# EasyEDA Pro project 8-Bit Breadboard Computer Schematics.eprj

# Schematic PC
Create Date: 2025-08-08; Page Name: Program Counter; Project Name: 8-Bit Breadboard Computer Schematics; Schematic Name: PC; Update Date: 2025-08-18; Company: EasyEDA.com; Page Size: A4; Version: V1.0
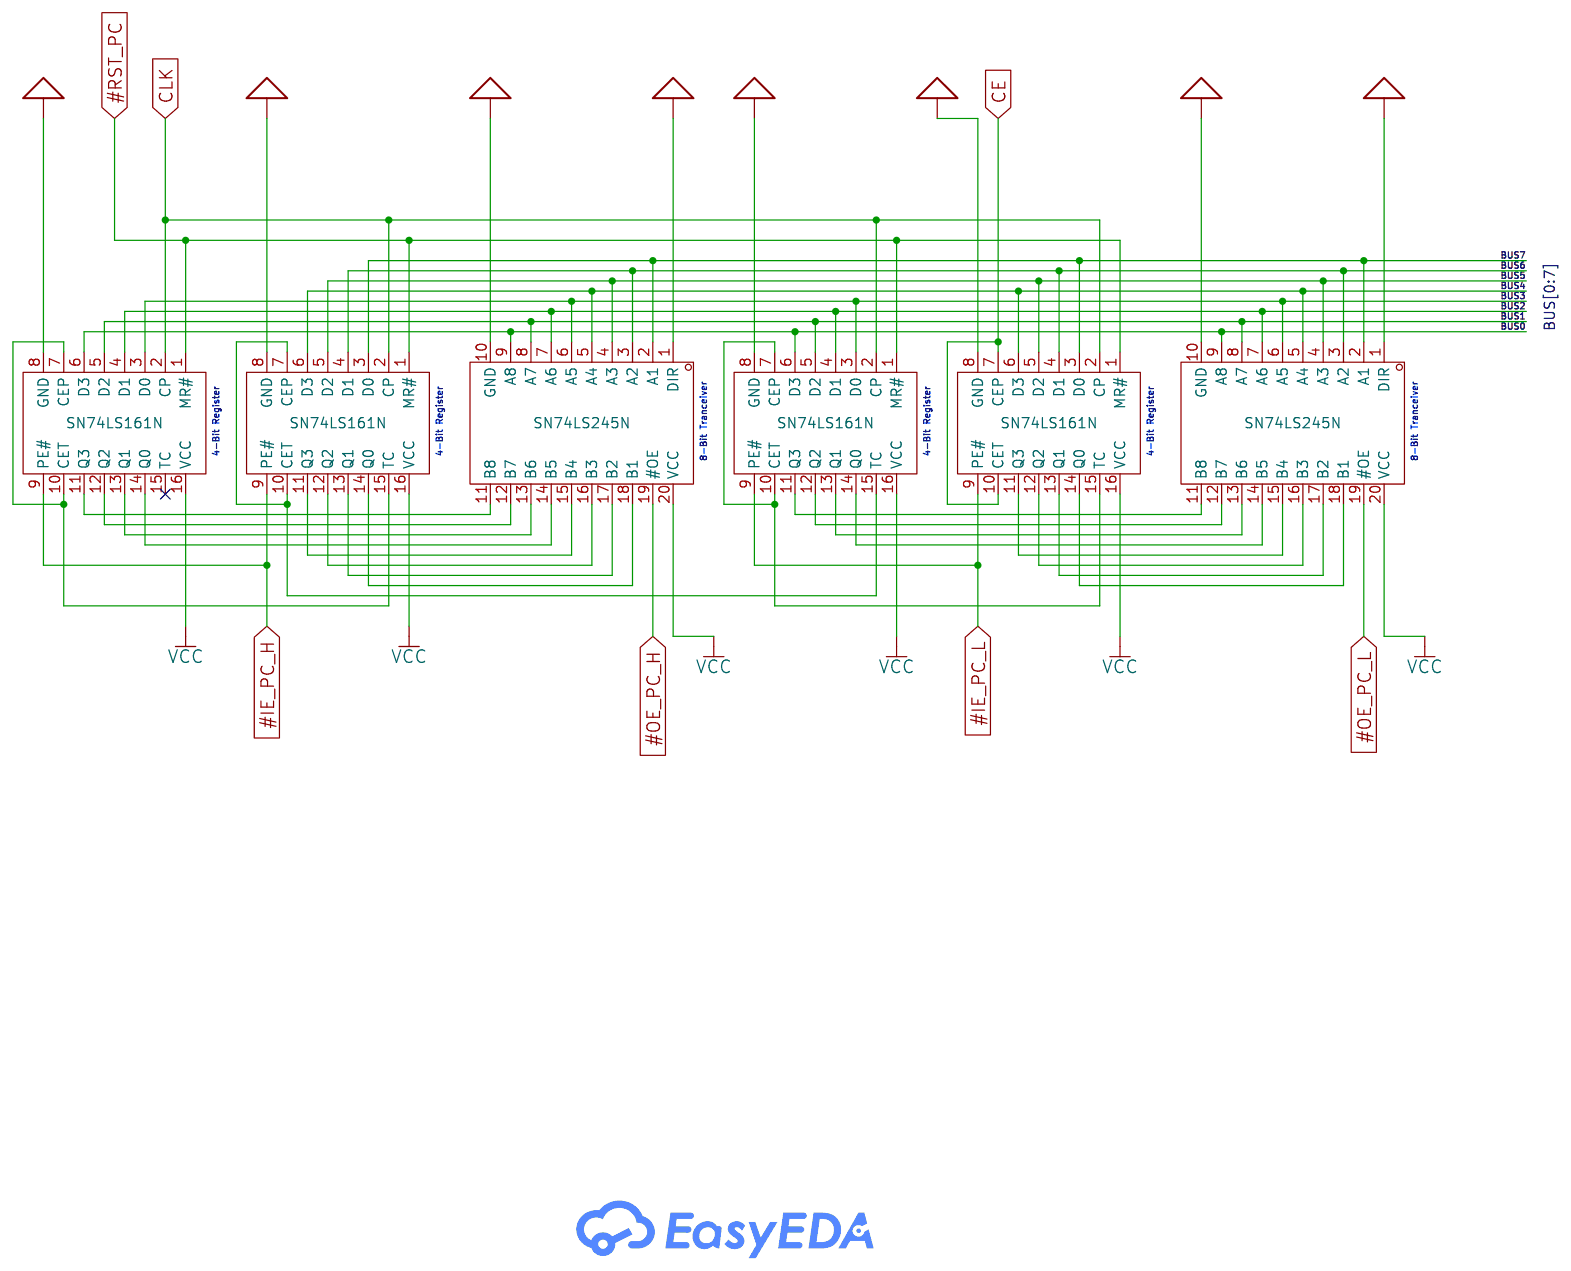
[diagram p0: schematic sheet]

## Parts
U6  SN74LS245N  [DIP-20_L25.5-W10.0-P2.54-LS7.6-BL]
U7  SN74LS161N  [PDIP-16_L19.3-W6.4-P2.54-LS7.94-BL]
U11  SN74LS161N  [PDIP-16_L19.3-W6.4-P2.54-LS7.94-BL]
U12  SN74LS245N  [DIP-20_L25.5-W10.0-P2.54-LS7.6-BL]
U13  SN74LS161N  [PDIP-16_L19.3-W6.4-P2.54-LS7.94-BL]
U14  SN74LS161N  [PDIP-16_L19.3-W6.4-P2.54-LS7.94-BL]

## Library data of the parts
U6 U12 = SN74LS245N: Supplier Part: C352966; Manufacturer: TI(德州仪器); Supplier Footprint: DIP-20; JLCPCB Part Class: Extended Part; Datasheet: https://www.ti.com/cn/lit/gpn/sn74ls245; Supplier: LCSC; output type: Tri-State; Voltage - Supply: 4.75V~5.25V; Number of Elements: 1; Number of Bits per Element: 8; Current - Output Low(IOL): 24mA; Current - Output High(IOH): 15mA; Logic Family: 74LS; Operating Temperature: 0℃~+70℃
U7 U11 U13 U14 = SN74LS161N(LX): Supplier Part: C22449622; Manufacturer: LX(灵星芯微); Supplier Footprint: DIP-16; JLCPCB Part Class: Extended Part; Datasheet: https://atta.szlcsc.com/upload/public/pdf/source/20240603/93FAE93C61248A77FCA8A2A231F511F6.pdf; Supplier: LCSC; Logic Type: 2-way split; Direction: Up Counter; Voltage - Supply: 2V~6V; Number of Elements: 1; Trigger Type: Rising Edge; Reset: Asynchronous; Timing: Synchronous; Count Rate: 27MHz; Operating Temperature: -40℃~+125℃

## Nets
GND: U6.1(DIR) U6.10(GND) U7.8(GND) U11.8(GND) U12.1(DIR) U12.10(GND) U13.8(GND) U14.8(GND)
VCC: U6.20(VCC) U7.16(VCC) U11.16(VCC) U12.20(VCC) U13.16(VCC) U14.16(VCC)
#IE_PC_H: U7.9(PE#) U11.9(PE#)
#IE_PC_L: U13.9(PE#) U14.9(PE#)
#OE_PC_H: U6.19(#OE)
#OE_PC_L: U12.19(#OE)
#RST_PC: U7.1(MR#) U11.1(MR#) U13.1(MR#) U14.1(MR#)
BUS0: U6.9(A8) U11.6(D3) U12.9(A8) U14.6(D3)
BUS1: U6.8(A7) U11.5(D2) U12.8(A7) U14.5(D2)
BUS2: U6.7(A6) U11.4(D1) U12.7(A6) U14.4(D1)
BUS3: U6.6(A5) U11.3(D0) U12.6(A5) U14.3(D0)
BUS4: U6.5(A4) U7.6(D3) U12.5(A4) U13.6(D3)
BUS5: U6.4(A3) U7.5(D2) U12.4(A3) U13.5(D2)
BUS6: U6.3(A2) U7.4(D1) U12.3(A2) U13.4(D1)
BUS7: U6.2(A1) U7.3(D0) U12.2(A1) U13.3(D0)
CE: U13.7(CEP) U13.10(CET)
CLK: U7.2(CP) U11.2(CP) U13.2(CP) U14.2(CP)
Net-(U6-11): U6.11(B8) U11.11(Q3)
Net-(U6-12): U6.12(B7) U11.12(Q2)
Net-(U6-13): U6.13(B6) U11.13(Q1)
Net-(U6-14): U6.14(B5) U11.14(Q0)
Net-(U6-15): U6.15(B4) U7.11(Q3)
Net-(U6-16): U6.16(B3) U7.12(Q2)
Net-(U6-17): U6.17(B2) U7.13(Q1)
Net-(U6-18): U6.18(B1) U7.14(Q0)
Net-(U7-7): U7.7(CEP) U7.10(CET) U14.15(TC)
Net-(U7-15): U7.15(TC) U11.7(CEP) U11.10(CET)
Net-(U12-11): U12.11(B8) U14.11(Q3)
Net-(U12-12): U12.12(B7) U14.12(Q2)
Net-(U12-13): U12.13(B6) U14.13(Q1)
Net-(U12-14): U12.14(B5) U14.14(Q0)
Net-(U12-15): U12.15(B4) U13.11(Q3)
Net-(U12-16): U12.16(B3) U13.12(Q2)
Net-(U12-17): U12.17(B2) U13.13(Q1)
Net-(U12-18): U12.18(B1) U13.14(Q0)
Net-(U13-15): U13.15(TC) U14.7(CEP) U14.10(CET)

Not connected (* = marked no-connect by the designer): U11 15(TC)*

## Notes on the sheet
- 4-Bit Register
- 4-Bit Register
- 8-Bit Tranceiver
- 4-Bit Register
- 4-Bit Register
- 8-Bit Tranceiver

# Schematic A-Regsiter
Create Date: 2025-08-08; Page Name: A-Regsiter; Project Name: 8-Bit Breadboard Computer Schematics; Schematic Name: A-Regsiter; Update Date: 2025-08-20; Company: EasyEDA.com; Page Size: A4; Version: V1.0
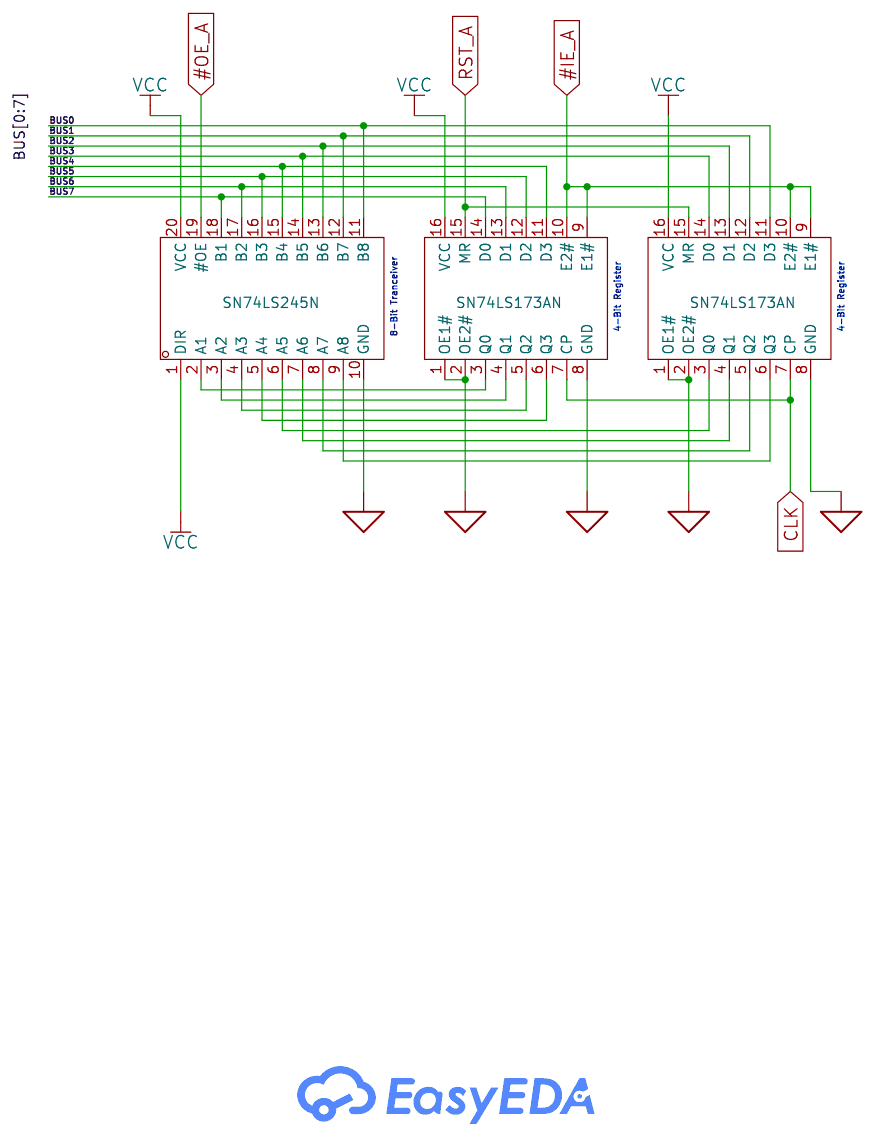
[diagram p1: schematic sheet]

## Parts
U1  SN74LS245N  [DIP-20_L25.5-W10.0-P2.54-LS7.6-BL]
U2  SN74LS173AN  [PDIP-16_L19.3-W6.4-P2.54-LS7.94-BL]
U3  SN74LS173AN  [PDIP-16_L19.3-W6.4-P2.54-LS7.94-BL]

## Library data of the parts
U1 = SN74LS245N: Supplier Part: C352966; Manufacturer: TI(德州仪器); Supplier Footprint: DIP-20; JLCPCB Part Class: Extended Part; Datasheet: https://www.ti.com/cn/lit/gpn/sn74ls245; Supplier: LCSC; output type: Tri-State; Voltage - Supply: 4.75V~5.25V; Number of Elements: 1; Number of Bits per Element: 8; Current - Output Low(IOL): 24mA; Current - Output High(IOH): 15mA; Logic Family: 74LS; Operating Temperature: 0℃~+70℃
U2 U3 = SN74LS173N(LX): LCSC Part Name: SN74LS173N; Supplier Part: C22466320; Manufacturer: LX(灵星芯微); Supplier Footprint: DIP-16; JLCPCB Part Class: Extended Part; Datasheet: https://atta.szlcsc.com/upload/public/pdf/source/20240614/F3FD9DFBB4BF77D77E15C2CBAE389656.pdf; Supplier: LCSC; Type: D-Type; Trigger Type: Rising Edge; Voltage - Supply: 2V~6V; Clock Frequency: 35MHz; Function: Reset; Number of Elements: 1; Number of Bits per Element: 4; Propagation Delay: 30ns@6V,50pF; Series: 74LS Series; Quiescent Current: 8uA; Operating Temperature: -40℃~+125℃

## Nets
GND: U1.10(GND) U2.1(OE1#) U2.2(OE2#) U2.8(GND) U3.1(OE1#) U3.2(OE2#) U3.8(GND)
VCC: U1.1(DIR) U1.20(VCC) U2.16(VCC) U3.16(VCC)
#IE_A: U2.9(E1#) U2.10(E2#) U3.9(E1#) U3.10(E2#)
#OE_A: U1.19(#OE)
BUS0: U1.11(B8) U3.11(D3)
BUS1: U1.12(B7) U3.12(D2)
BUS2: U1.13(B6) U3.13(D1)
BUS3: U1.14(B5) U3.14(D0)
BUS4: U1.15(B4) U2.11(D3)
BUS5: U1.16(B3) U2.12(D2)
BUS6: U1.17(B2) U2.13(D1)
BUS7: U1.18(B1) U2.14(D0)
CLK: U2.7(CP) U3.7(CP)
RST_A: U2.15(MR) U3.15(MR)
Net-(U1-2): U1.2(A1) U2.3(Q0)
Net-(U1-3): U1.3(A2) U2.4(Q1)
Net-(U1-4): U1.4(A3) U2.5(Q2)
Net-(U1-5): U1.5(A4) U2.6(Q3)
Net-(U1-6): U1.6(A5) U3.3(Q0)
Net-(U1-7): U1.7(A6) U3.4(Q1)
Net-(U1-8): U1.8(A7) U3.5(Q2)
Net-(U1-9): U1.9(A8) U3.6(Q3)

## Notes on the sheet
- 8-Bit Tranceiver
- 4-Bit Register
- 4-Bit Register

# Schematic ALU
Create Date: 2025-08-18; Page Name: Arithmetic Logic Unit; Project Name: 8-Bit Breadboard Computer Schematics; Schematic Name: ALU; Update Date: 2025-08-30; Company: EasyEDA.com; Page Size: A4; Version: V1.0
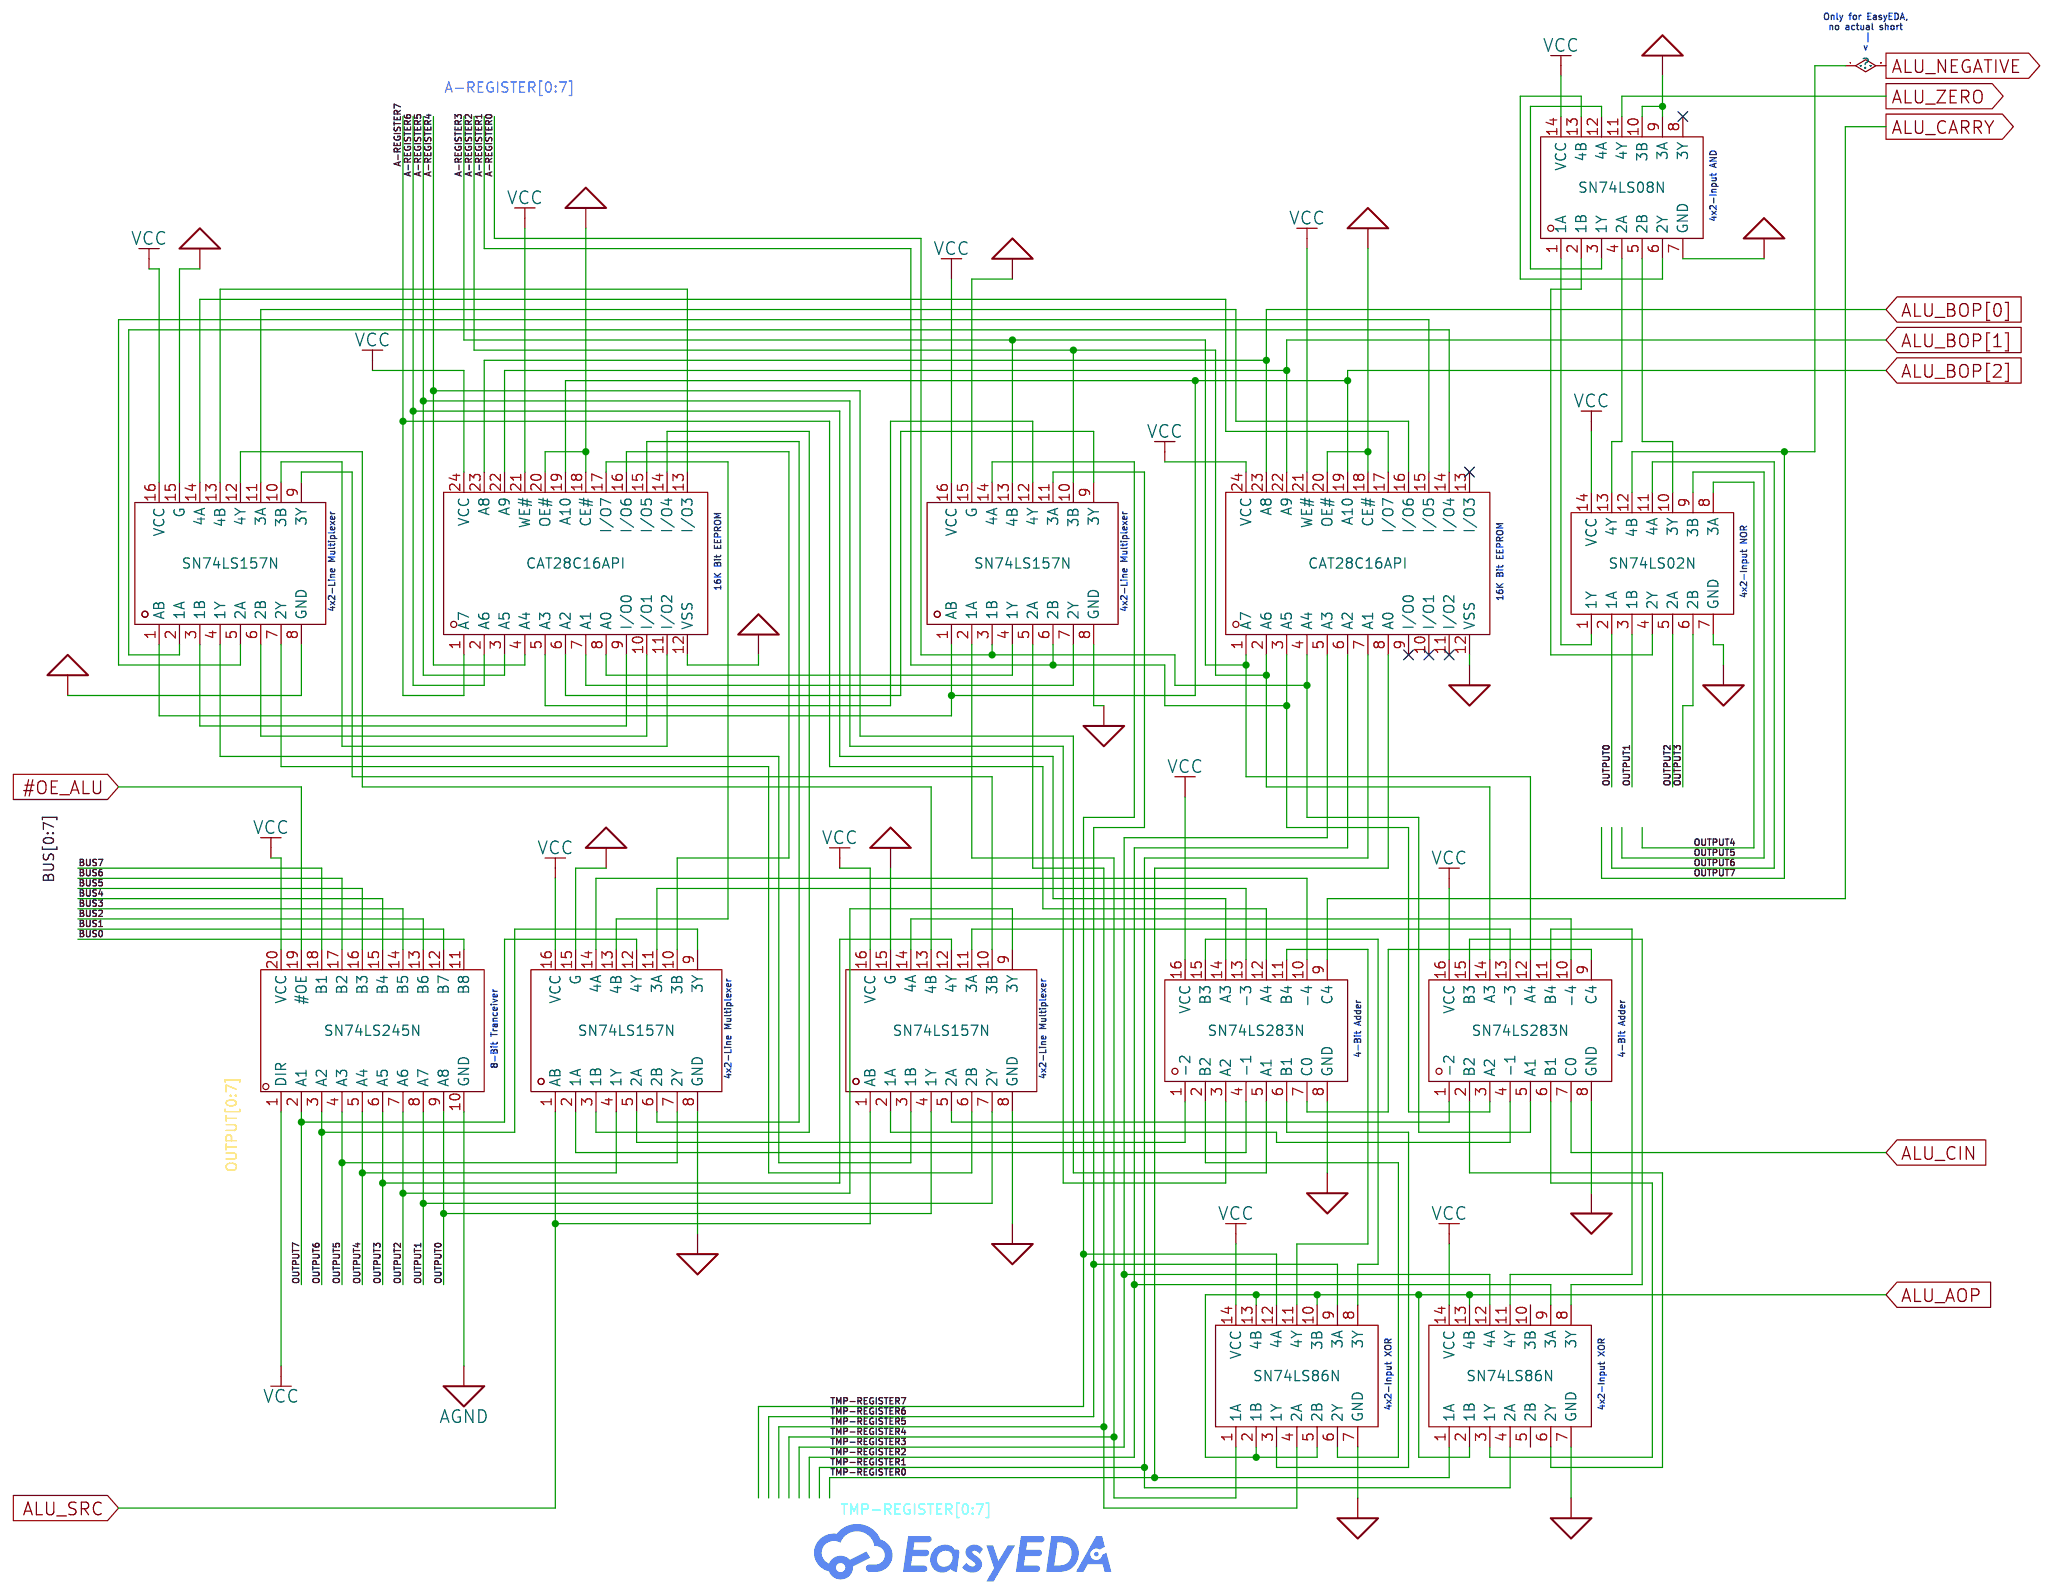
[diagram p2: schematic sheet]

## Parts
U1  SN74LS283N  [PDIP-16_L19.3-W6.4-P2.54-LS7.94-BL]
U2  SN74LS283N  [PDIP-16_L19.3-W6.4-P2.54-LS7.94-BL]
U6  SN74LS245N  [DIP-20_L25.5-W10.0-P2.54-LS7.6-BL]
U7  SN74LS86N  [DIP-14_L19.0-W6.4-P2.54-LS7.6-BL]
U8  SN74LS86N  [DIP-14_L19.0-W6.4-P2.54-LS7.6-BL]
U9  CAT28C16API  [SOIC-24_L15.4-W7.5-P1.27-LS10.3-BL]
U10  CAT28C16API  [SOIC-24_L15.4-W7.5-P1.27-LS10.3-BL]
U11  SN74LS02N  [PDIP-14_L19.2-W6.4-P2.54-LS8.0-BL]
U12  SN74LS08N  [PDIP-14_L19.3-W6.4-P2.54-LS7.9-BL-1]
U13  SN74LS157N  [DIP-16_16P-L20.2-W6.6-P2.54-LS7.6-BL]
U14  SN74LS157N  [DIP-16_16P-L20.2-W6.6-P2.54-LS7.6-BL]
U15  SN74LS157N  [DIP-16_16P-L20.2-W6.6-P2.54-LS7.6-BL]
U16  SN74LS157N  [DIP-16_16P-L20.2-W6.6-P2.54-LS7.6-BL]

## Library data of the parts
U1 U2 = SN74LS283N: LCSC Part Name: 二进制全加器; Supplier Part: C1523494; Manufacturer: TI(德州仪器); Supplier Footprint: PDIP-16; JLCPCB Part Class: Extended Part; Datasheet: https://www.ti.com/cn/lit/gpn/sn74ls283; Supplier: LCSC
U6 = SN74LS245N: Supplier Part: C352966; Manufacturer: TI(德州仪器); Supplier Footprint: DIP-20; JLCPCB Part Class: Extended Part; Datasheet: https://www.ti.com/cn/lit/gpn/sn74ls245; Supplier: LCSC; output type: Tri-State; Voltage - Supply: 4.75V~5.25V; Number of Elements: 1; Number of Bits per Element: 8; Current - Output Low(IOL): 24mA; Current - Output High(IOH): 15mA; Logic Family: 74LS; Operating Temperature: 0℃~+70℃
U7 U8 = SN74LS86N(XBLW): Supplier Part: C42415784; Manufacturer: XBLW(芯伯乐); Supplier Footprint: DIP-14; Datasheet: https://atta.szlcsc.com/upload/public/pdf/source/20241217/4BD867E8FF5FB27D45A6321784BC3EB1.pdf; Supplier: LCSC; Logic Type: XOR Gate; Number of Channels: 4; Voltage - Supply: 2V~6V; Quiescent Current: 2uA; Current - Output Low(IOL): 5.2mA; Current - Output High(IOH): 5.2mA; Input Logic Level - High: 1.2V~3.2V; Input Logic Level - Low: 800mV~2.8V; Output Logic Level - High: 2V~5.81V
U9 U10 = CAT28C16AW-12T: Supplier Part: C19450917; Manufacturer: onsemi(安森美); Supplier Footprint: SOIC-24; JLCPCB Part Class: Extended Part; Datasheet: https://atta.szlcsc.com/upload/public/pdf/source/20231219/EED2F641C9F733CA6F2D719AC278C6D7.pdf; Supplier: LCSC
U11 = SN74LS02N(LX): LCSC Part Name: 4路2输入或非门; Supplier Part: C22374091; Manufacturer: LX(灵星芯微); Supplier Footprint: DIP-14; JLCPCB Part Class: Extended Part; Datasheet: https://item.szlcsc.com/datasheet/SN74LS02N(LX)/23871147.html; Supplier: LCSC; Logic Type: NOR Gate; Number of Channels: 4; Voltage - Supply: 2V~6V; Current - Output Low(IOL): 5.2mA; Current - Output High(IOH): 5.2mA; Input Logic Level - High: 1.5V~4.2V; Input Logic Level - Low: 500mV~1.8V; Series: 74LS Series; Propagation Delay: 15ns@6V; Operating Temperature: -40℃~+125℃
U12 = SN74LS08N: Supplier Part: C2869595; Manufacturer: TI(德州仪器); Supplier Footprint: PDIP-14; JLCPCB Part Class: Extended Part; Datasheet: https://www.ti.com/cn/lit/gpn/sn54s08; Supplier: LCSC; Logic Type: AND Gate; Number of Channels: 4; Voltage - Supply: 4.75V~5.25V; Current - Output Low(IOL): 8mA; Current - Output High(IOH): 400uA; Input Logic Level - High: 2V; Input Logic Level - Low: 800mV; Series: 74LSSeries; Operating Temperature: 0℃~+70℃
U13-U16 = SN74LS157N: Supplier Part: C139317; Manufacturer: TI(德州仪器); Supplier Footprint: DIP-16; JLCPCB Part Class: Extended Part; Datasheet: https://www.ti.com/cn/lit/gpn/sn74ls157; Supplier: LCSC; Type: Multiplexers; Voltage Supply Source: Single supply; Supply Voltage: 4.75V~5.25V; Sink Current: 8mA; Source Current: 400uA; Operating temperature: 0℃~+70℃

## Nets
AGND: U6.10(GND)
GND: U1.8(GND) U2.8(GND) U7.7(GND) U8.7(GND) U9.12(VSS) U9.18(CE#) U9.20(OE#) U10.12(VSS) U10.18(CE#) U10.20(OE#) U11.7(GND) U12.7(GND) U12.9(3A) U12.10(3B) U13.8(GND) U13.15(G) U14.8(GND) U14.15(G) U15.8(GND) U15.15(G) U16.8(GND) U16.15(G)
VCC: U1.16(VCC) U2.16(VCC) U6.1(DIR) U6.20(VCC) U7.14(VCC) U8.14(VCC) U9.21(WE#) U9.24(VCC) U10.21(WE#) U10.24(VCC) U11.14(VCC) U12.14(VCC) U13.16(VCC) U14.16(VCC) U15.16(VCC) U16.16(VCC)
#OE_ALU: U6.19(#OE)
A-REGISTER0: U2.5(A1) U10.4(A4) U15.3(1B)
A-REGISTER1: U2.3(A2) U10.3(A5) U15.6(2B)
A-REGISTER2: U2.14(A3) U10.2(A6) U15.10(3B)
A-REGISTER3: U2.12(A4) U10.1(A7) U15.13(4B)
A-REGISTER4: U1.5(A1) U9.4(A4)
A-REGISTER5: U1.3(A2) U9.3(A5)
A-REGISTER6: U1.14(A3) U9.2(A6)
A-REGISTER7: U1.12(A4) U9.1(A7)
ALU_AOP: U7.2(1B) U7.5(2B) U7.10(3B) U7.13(4B) U8.2(1B) U8.13(4B)
ALU_BOP[0]: U9.23(A8) U10.23(A8)
ALU_BOP[1]: U9.22(A9) U10.22(A9)
ALU_BOP[2]: U9.19(A10) U10.19(A10) U14.1(AB) U15.1(AB)
ALU_CARRY: U1.9(C4)
ALU_CIN: U2.7(C0)
ALU_NEGATIVE: U6.2(A1) U11.12(4B) U13.12(4Y)
ALU_SRC: U13.1(AB) U16.1(AB)
ALU_ZERO: U12.11(4Y)
BUS0: U6.11(B8)
BUS1: U6.12(B7)
BUS2: U6.13(B6)
BUS3: U6.14(B5)
BUS4: U6.15(B4)
BUS5: U6.16(B3)
BUS6: U6.17(B2)
BUS7: U6.18(B1)
OUTPUT0: U6.9(A8) U11.2(1A) U16.4(1Y)
OUTPUT1: U6.8(A7) U11.3(1B) U16.7(2Y)
OUTPUT2: U6.7(A6) U11.5(2A) U16.9(3Y)
OUTPUT3: U6.6(A5) U11.6(2B) U16.12(4Y)
OUTPUT4: U6.5(A4) U11.8(3A) U13.4(1Y)
OUTPUT5: U6.4(A3) U11.9(3B) U13.7(2Y)
OUTPUT6: U6.3(A2) U11.11(4A) U13.9(3Y)
TMP-REGISTER0: U8.1(1A) U10.8(A0)
TMP-REGISTER1: U8.4(2A) U10.7(A1)
TMP-REGISTER2: U8.9(3A) U10.6(A2)
TMP-REGISTER3: U8.12(4A) U10.5(A3)
TMP-REGISTER4: U7.1(1A) U15.2(1A)
TMP-REGISTER5: U7.4(2A) U15.5(2A)
TMP-REGISTER6: U7.9(3A) U15.11(3A)
TMP-REGISTER7: U7.12(4A) U15.14(4A)
Net-(U1-1): U1.1(-2) U13.5(2A)
Net-(U1-2): U1.2(B2) U7.6(2Y)
Net-(U1-4): U1.4(-1) U13.2(1A)
Net-(U1-6): U1.6(B1) U7.3(1Y)
Net-(U1-7): U1.7(C0) U2.9(C4)
Net-(U1-10): U1.10(-4) U13.14(4A)
Net-(U1-11): U1.11(B4) U7.11(4Y)
Net-(U1-13): U1.13(-3) U13.11(3A)
Net-(U1-15): U1.15(B3) U7.8(3Y)
Net-(U2-1): U2.1(-2) U16.5(2A)
Net-(U2-2): U2.2(B2) U8.6(2Y)
Net-(U2-4): U2.4(-1) U16.2(1A)
Net-(U2-6): U2.6(B1) U8.3(1Y)
Net-(U2-10): U2.10(-4) U16.14(4A)
Net-(U2-11): U2.11(B4) U8.11(4Y)
Net-(U2-13): U2.13(-3) U16.11(3A)
Net-(U2-15): U2.15(B3) U8.8(3Y)
Net-(U9-5): U9.5(A3) U15.12(4Y)
Net-(U9-6): U9.6(A2) U15.9(3Y)
Net-(U9-7): U9.7(A1) U15.7(2Y)
Net-(U9-8): U9.8(A0) U15.4(1Y)
Net-(U9-9): U9.9(I/O0) U14.3(1B)
Net-(U9-10): U9.10(I/O1) U14.6(2B)
Net-(U9-11): U9.11(I/O2) U14.10(3B)
Net-(U9-13): U9.13(I/O3) U14.13(4B)
Net-(U9-14): U9.14(I/O4) U13.3(1B)
Net-(U9-15): U9.15(I/O5) U13.6(2B)
Net-(U9-16): U9.16(I/O6) U13.10(3B)
Net-(U9-17): U9.17(I/O7) U13.13(4B)
Net-(U10-14): U10.14(I/O4) U14.2(1A)
Net-(U10-15): U10.15(I/O5) U14.5(2A)
Net-(U10-16): U10.16(I/O6) U14.11(3A)
Net-(U10-17): U10.17(I/O7) U14.14(4A)
Net-(U11-1): U11.1(1Y) U12.1(1A)
Net-(U11-4): U11.4(2Y) U12.2(1B)
Net-(U11-10): U11.10(3Y) U12.5(2B)
Net-(U11-13): U11.13(4Y) U12.4(2A)
Net-(U12-3): U12.3(1Y) U12.12(4A)
Net-(U12-6): U12.6(2Y) U12.13(4B)
Net-(U14-4): U14.4(1Y) U16.3(1B)
Net-(U14-7): U14.7(2Y) U16.6(2B)
Net-(U14-9): U14.9(3Y) U16.10(3B)
Net-(U14-12): U14.12(4Y) U16.13(4B)

Not connected (* = marked no-connect by the designer): U8 5(2B) 10(3B); U10 9(I/O0)* 10(I/O1)* 11(I/O2)* 13(I/O3)*; U12 8(3Y)*

## Notes on the sheet
- Only for EasyEDA,
  no actual short
   |
  v
- 4x2-Input AND
- 16K Bit EEPROM
- 4x2-Line Multiplexer
- 4x2-Line Multiplexer
- 16K Bit EEPROM
- 4x2-Input NOR
- 8-Bit Tranceiver
- 4x2-Line Multiplexer
- 4x2-Line Multiplexer
- 4-Bit Adder
- 4-Bit Adder
- 4x2-Input XOR
- 4x2-Input XOR

# Schematic B-Regsiter
Create Date: 2025-08-20; Page Name: B-Regsiter; Project Name: 8-Bit Breadboard Computer Schematics; Schematic Name: B-Regsiter; Update Date: 2025-08-20; Company: EasyEDA.com; Page Size: A4; Version: V1.0
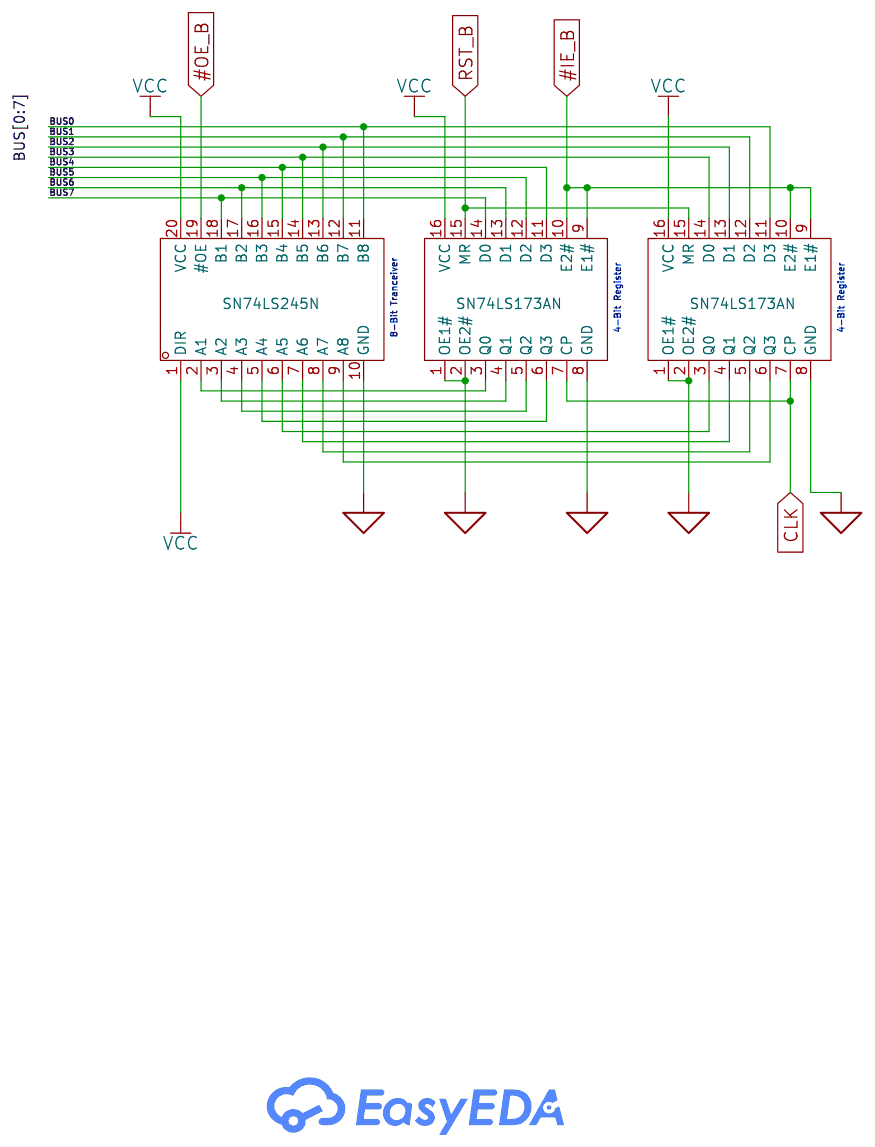
[diagram p3: schematic sheet]

## Parts
U1  SN74LS245N  [DIP-20_L25.5-W10.0-P2.54-LS7.6-BL]
U2  SN74LS173AN  [PDIP-16_L19.3-W6.4-P2.54-LS7.94-BL]
U3  SN74LS173AN  [PDIP-16_L19.3-W6.4-P2.54-LS7.94-BL]

## Library data of the parts
U1 = SN74LS245N: Supplier Part: C352966; Manufacturer: TI(德州仪器); Supplier Footprint: DIP-20; JLCPCB Part Class: Extended Part; Datasheet: https://www.ti.com/cn/lit/gpn/sn74ls245; Supplier: LCSC; output type: Tri-State; Voltage - Supply: 4.75V~5.25V; Number of Elements: 1; Number of Bits per Element: 8; Current - Output Low(IOL): 24mA; Current - Output High(IOH): 15mA; Logic Family: 74LS; Operating Temperature: 0℃~+70℃
U2 U3 = SN74LS173N(LX): LCSC Part Name: SN74LS173N; Supplier Part: C22466320; Manufacturer: LX(灵星芯微); Supplier Footprint: DIP-16; JLCPCB Part Class: Extended Part; Datasheet: https://atta.szlcsc.com/upload/public/pdf/source/20240614/F3FD9DFBB4BF77D77E15C2CBAE389656.pdf; Supplier: LCSC; Type: D-Type; Trigger Type: Rising Edge; Voltage - Supply: 2V~6V; Clock Frequency: 35MHz; Function: Reset; Number of Elements: 1; Number of Bits per Element: 4; Propagation Delay: 30ns@6V,50pF; Series: 74LS Series; Quiescent Current: 8uA; Operating Temperature: -40℃~+125℃

## Nets
GND: U1.10(GND) U2.1(OE1#) U2.2(OE2#) U2.8(GND) U3.1(OE1#) U3.2(OE2#) U3.8(GND)
VCC: U1.1(DIR) U1.20(VCC) U2.16(VCC) U3.16(VCC)
#IE_B: U2.9(E1#) U2.10(E2#) U3.9(E1#) U3.10(E2#)
#OE_B: U1.19(#OE)
BUS0: U1.11(B8) U3.11(D3)
BUS1: U1.12(B7) U3.12(D2)
BUS2: U1.13(B6) U3.13(D1)
BUS3: U1.14(B5) U3.14(D0)
BUS4: U1.15(B4) U2.11(D3)
BUS5: U1.16(B3) U2.12(D2)
BUS6: U1.17(B2) U2.13(D1)
BUS7: U1.18(B1) U2.14(D0)
CLK: U2.7(CP) U3.7(CP)
RST_B: U2.15(MR) U3.15(MR)
Net-(U1-2): U1.2(A1) U2.3(Q0)
Net-(U1-3): U1.3(A2) U2.4(Q1)
Net-(U1-4): U1.4(A3) U2.5(Q2)
Net-(U1-5): U1.5(A4) U2.6(Q3)
Net-(U1-6): U1.6(A5) U3.3(Q0)
Net-(U1-7): U1.7(A6) U3.4(Q1)
Net-(U1-8): U1.8(A7) U3.5(Q2)
Net-(U1-9): U1.9(A8) U3.6(Q3)

## Notes on the sheet
- 8-Bit Tranceiver
- 4-Bit Register
- 4-Bit Register

# Schematic C-Regsiter
Create Date: 2025-08-20; Page Name: C-Regsiter; Project Name: 8-Bit Breadboard Computer Schematics; Schematic Name: C-Regsiter; Update Date: 2025-08-20; Company: EasyEDA.com; Page Size: A4; Version: V1.0
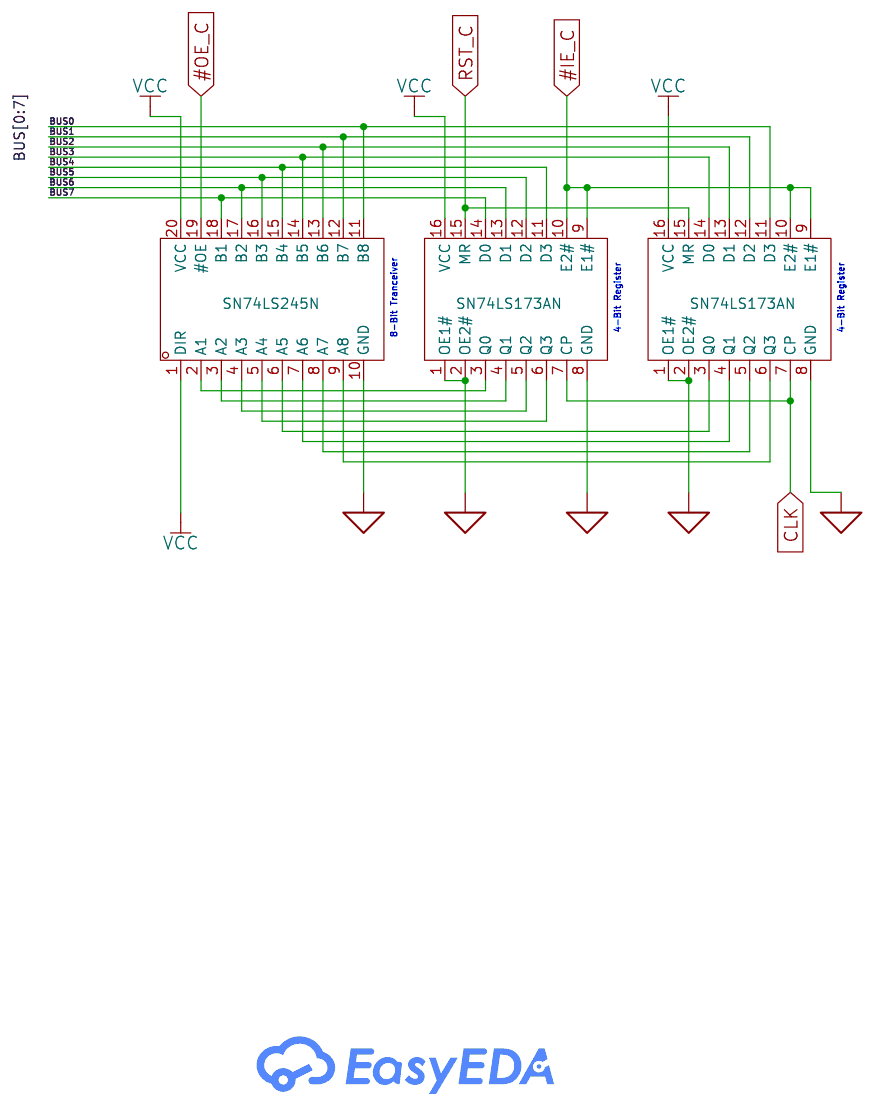
[diagram p4: schematic sheet]

## Parts
U1  SN74LS245N  [DIP-20_L25.5-W10.0-P2.54-LS7.6-BL]
U2  SN74LS173AN  [PDIP-16_L19.3-W6.4-P2.54-LS7.94-BL]
U3  SN74LS173AN  [PDIP-16_L19.3-W6.4-P2.54-LS7.94-BL]

## Library data of the parts
U1 = SN74LS245N: Supplier Part: C352966; Manufacturer: TI(德州仪器); Supplier Footprint: DIP-20; JLCPCB Part Class: Extended Part; Datasheet: https://www.ti.com/cn/lit/gpn/sn74ls245; Supplier: LCSC; output type: Tri-State; Voltage - Supply: 4.75V~5.25V; Number of Elements: 1; Number of Bits per Element: 8; Current - Output Low(IOL): 24mA; Current - Output High(IOH): 15mA; Logic Family: 74LS; Operating Temperature: 0℃~+70℃
U2 U3 = SN74LS173N(LX): LCSC Part Name: SN74LS173N; Supplier Part: C22466320; Manufacturer: LX(灵星芯微); Supplier Footprint: DIP-16; JLCPCB Part Class: Extended Part; Datasheet: https://atta.szlcsc.com/upload/public/pdf/source/20240614/F3FD9DFBB4BF77D77E15C2CBAE389656.pdf; Supplier: LCSC; Type: D-Type; Trigger Type: Rising Edge; Voltage - Supply: 2V~6V; Clock Frequency: 35MHz; Function: Reset; Number of Elements: 1; Number of Bits per Element: 4; Propagation Delay: 30ns@6V,50pF; Series: 74LS Series; Quiescent Current: 8uA; Operating Temperature: -40℃~+125℃

## Nets
GND: U1.10(GND) U2.1(OE1#) U2.2(OE2#) U2.8(GND) U3.1(OE1#) U3.2(OE2#) U3.8(GND)
VCC: U1.1(DIR) U1.20(VCC) U2.16(VCC) U3.16(VCC)
#IE_C: U2.9(E1#) U2.10(E2#) U3.9(E1#) U3.10(E2#)
#OE_C: U1.19(#OE)
BUS0: U1.11(B8) U3.11(D3)
BUS1: U1.12(B7) U3.12(D2)
BUS2: U1.13(B6) U3.13(D1)
BUS3: U1.14(B5) U3.14(D0)
BUS4: U1.15(B4) U2.11(D3)
BUS5: U1.16(B3) U2.12(D2)
BUS6: U1.17(B2) U2.13(D1)
BUS7: U1.18(B1) U2.14(D0)
CLK: U2.7(CP) U3.7(CP)
RST_C: U2.15(MR) U3.15(MR)
Net-(U1-2): U1.2(A1) U2.3(Q0)
Net-(U1-3): U1.3(A2) U2.4(Q1)
Net-(U1-4): U1.4(A3) U2.5(Q2)
Net-(U1-5): U1.5(A4) U2.6(Q3)
Net-(U1-6): U1.6(A5) U3.3(Q0)
Net-(U1-7): U1.7(A6) U3.4(Q1)
Net-(U1-8): U1.8(A7) U3.5(Q2)
Net-(U1-9): U1.9(A8) U3.6(Q3)

## Notes on the sheet
- 8-Bit Tranceiver
- 4-Bit Register
- 4-Bit Register

# Schematic TMP-Regsiter
Create Date: 2025-08-20; Page Name: T-Regsiter; Project Name: 8-Bit Breadboard Computer Schematics; Schematic Name: TMP-Regsiter; Update Date: 2025-08-20; Company: EasyEDA.com; Page Size: A4; Version: V1.0
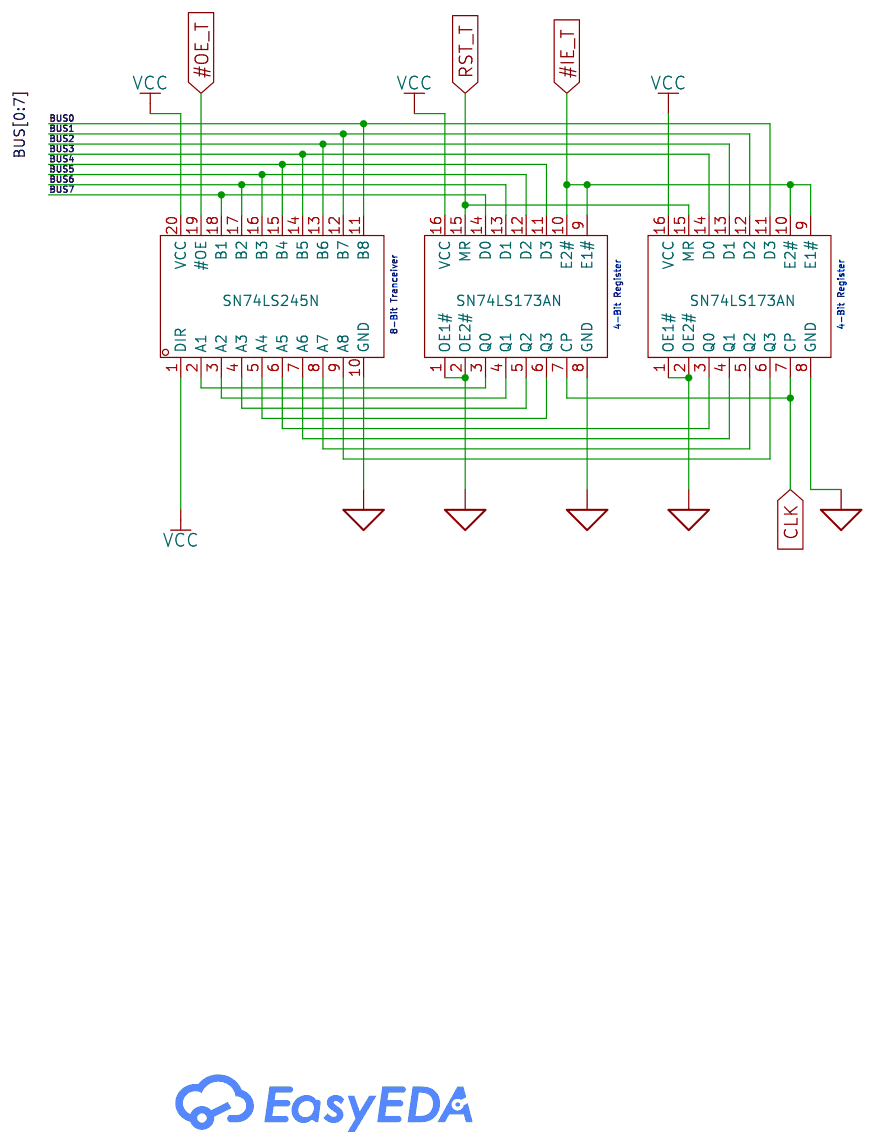
[diagram p5: schematic sheet]

## Parts
U1  SN74LS245N  [DIP-20_L25.5-W10.0-P2.54-LS7.6-BL]
U2  SN74LS173AN  [PDIP-16_L19.3-W6.4-P2.54-LS7.94-BL]
U3  SN74LS173AN  [PDIP-16_L19.3-W6.4-P2.54-LS7.94-BL]

## Library data of the parts
U1 = SN74LS245N: Supplier Part: C352966; Manufacturer: TI(德州仪器); Supplier Footprint: DIP-20; JLCPCB Part Class: Extended Part; Datasheet: https://www.ti.com/cn/lit/gpn/sn74ls245; Supplier: LCSC; output type: Tri-State; Voltage - Supply: 4.75V~5.25V; Number of Elements: 1; Number of Bits per Element: 8; Current - Output Low(IOL): 24mA; Current - Output High(IOH): 15mA; Logic Family: 74LS; Operating Temperature: 0℃~+70℃
U2 U3 = SN74LS173N(LX): LCSC Part Name: SN74LS173N; Supplier Part: C22466320; Manufacturer: LX(灵星芯微); Supplier Footprint: DIP-16; JLCPCB Part Class: Extended Part; Datasheet: https://atta.szlcsc.com/upload/public/pdf/source/20240614/F3FD9DFBB4BF77D77E15C2CBAE389656.pdf; Supplier: LCSC; Type: D-Type; Trigger Type: Rising Edge; Voltage - Supply: 2V~6V; Clock Frequency: 35MHz; Function: Reset; Number of Elements: 1; Number of Bits per Element: 4; Propagation Delay: 30ns@6V,50pF; Series: 74LS Series; Quiescent Current: 8uA; Operating Temperature: -40℃~+125℃

## Nets
GND: U1.10(GND) U2.1(OE1#) U2.2(OE2#) U2.8(GND) U3.1(OE1#) U3.2(OE2#) U3.8(GND)
VCC: U1.1(DIR) U1.20(VCC) U2.16(VCC) U3.16(VCC)
#IE_T: U2.9(E1#) U2.10(E2#) U3.9(E1#) U3.10(E2#)
#OE_T: U1.19(#OE)
BUS0: U1.11(B8) U3.11(D3)
BUS1: U1.12(B7) U3.12(D2)
BUS2: U1.13(B6) U3.13(D1)
BUS3: U1.14(B5) U3.14(D0)
BUS4: U1.15(B4) U2.11(D3)
BUS5: U1.16(B3) U2.12(D2)
BUS6: U1.17(B2) U2.13(D1)
BUS7: U1.18(B1) U2.14(D0)
CLK: U2.7(CP) U3.7(CP)
RST_T: U2.15(MR) U3.15(MR)
Net-(U1-2): U1.2(A1) U2.3(Q0)
Net-(U1-3): U1.3(A2) U2.4(Q1)
Net-(U1-4): U1.4(A3) U2.5(Q2)
Net-(U1-5): U1.5(A4) U2.6(Q3)
Net-(U1-6): U1.6(A5) U3.3(Q0)
Net-(U1-7): U1.7(A6) U3.4(Q1)
Net-(U1-8): U1.8(A7) U3.5(Q2)
Net-(U1-9): U1.9(A8) U3.6(Q3)

## Notes on the sheet
- 8-Bit Tranceiver
- 4-Bit Register
- 4-Bit Register

# Schematic Flags-Register
Create Date: 2025-08-30; Page Name: Flags-Register; Project Name: 8-Bit Breadboard Computer Schematics; Schematic Name: Flags-Register; Update Date: 2025-08-30; Company: EasyEDA.com; Page Size: A4; Version: V1.0
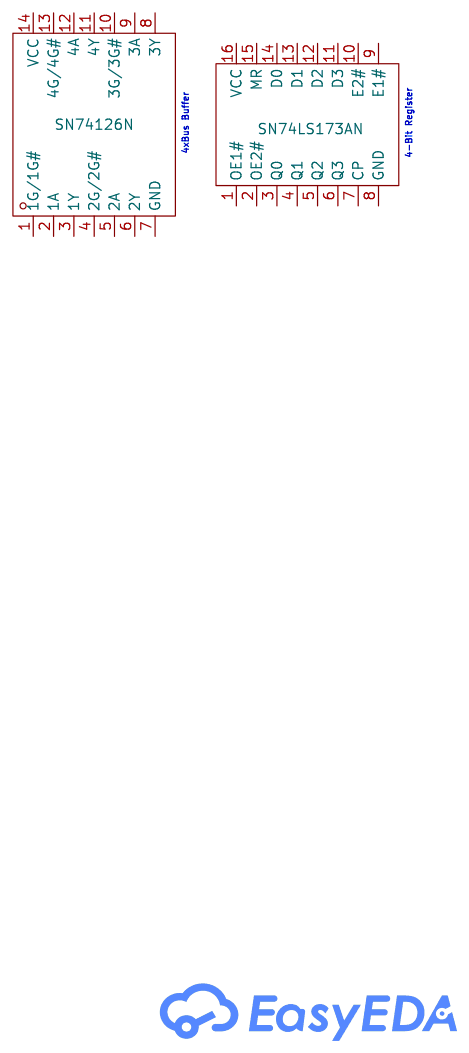
[diagram p6: schematic sheet]

## Parts
U3  SN74LS173AN  [PDIP-16_L19.3-W6.4-P2.54-LS7.94-BL]
U17  SN74126N  [PDIP-14_L19.3-W6.4-P2.54-LS7.9-BL-1]

## Library data of the parts
U3 = SN74LS173N(LX): LCSC Part Name: SN74LS173N; Supplier Part: C22466320; Manufacturer: LX(灵星芯微); Supplier Footprint: DIP-16; JLCPCB Part Class: Extended Part; Datasheet: https://atta.szlcsc.com/upload/public/pdf/source/20240614/F3FD9DFBB4BF77D77E15C2CBAE389656.pdf; Supplier: LCSC; Type: D-Type; Trigger Type: Rising Edge; Voltage - Supply: 2V~6V; Clock Frequency: 35MHz; Function: Reset; Number of Elements: 1; Number of Bits per Element: 4; Propagation Delay: 30ns@6V,50pF; Series: 74LS Series; Quiescent Current: 8uA; Operating Temperature: -40℃~+125℃
U17 = SN74126N: Supplier Part: C3755543; Manufacturer: TI(德州仪器); JLCPCB Part Class: Extended Part; Datasheet: https://atta.szlcsc.com/upload/public/pdf/source/20230921/D1683B70E3503115BE8957D2000F591F.pdf; Supplier: LCSC

## Nets

Not connected (* = marked no-connect by the designer): U3 1(OE1#) 2(OE2#) 3(Q0) 4(Q1) 5(Q2) 6(Q3) 7(CP) 8(GND) 9(E1#) 10(E2#) 11(D3) 12(D2) 13(D1) 14(D0) 15(MR) 16(VCC); U17 1(1G/1G#) 2(1A) 3(1Y) 4(2G/2G#) 5(2A) 6(2Y) 7(GND) 8(3Y) 9(3A) 10(3G/3G#) 11(4Y) 12(4A) 13(4G/4G#) 14(VCC)

## Notes on the sheet
- 4xBus Buffer
- 4-Bit Register
